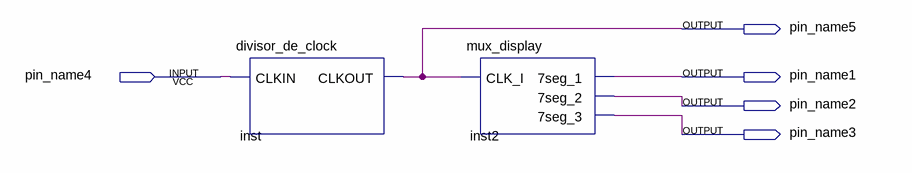
[diagram p0: schematic sheet]
// Quartus schematic projeto_de_teste.bdf as structural Verilog: 2 symbols, 5 pins
module projeto_de_teste (
  input  pin_name4,
  output pin_name5,
  output pin_name1,
  output pin_name2,
  output pin_name3
);

  divisor_de_clock inst (.CLKIN(pin_name4), .CLKOUT(pin_name5));
  mux_display inst2 (.CLK_I(pin_name5), .\7seg_1 (pin_name1), .\7seg_2 (pin_name2), .\7seg_3 (pin_name3));
endmodule
